# Altium schematic sheet 31-FT4232 UART TO USB BRIDG.SchDoc
size 513 x 386 mm
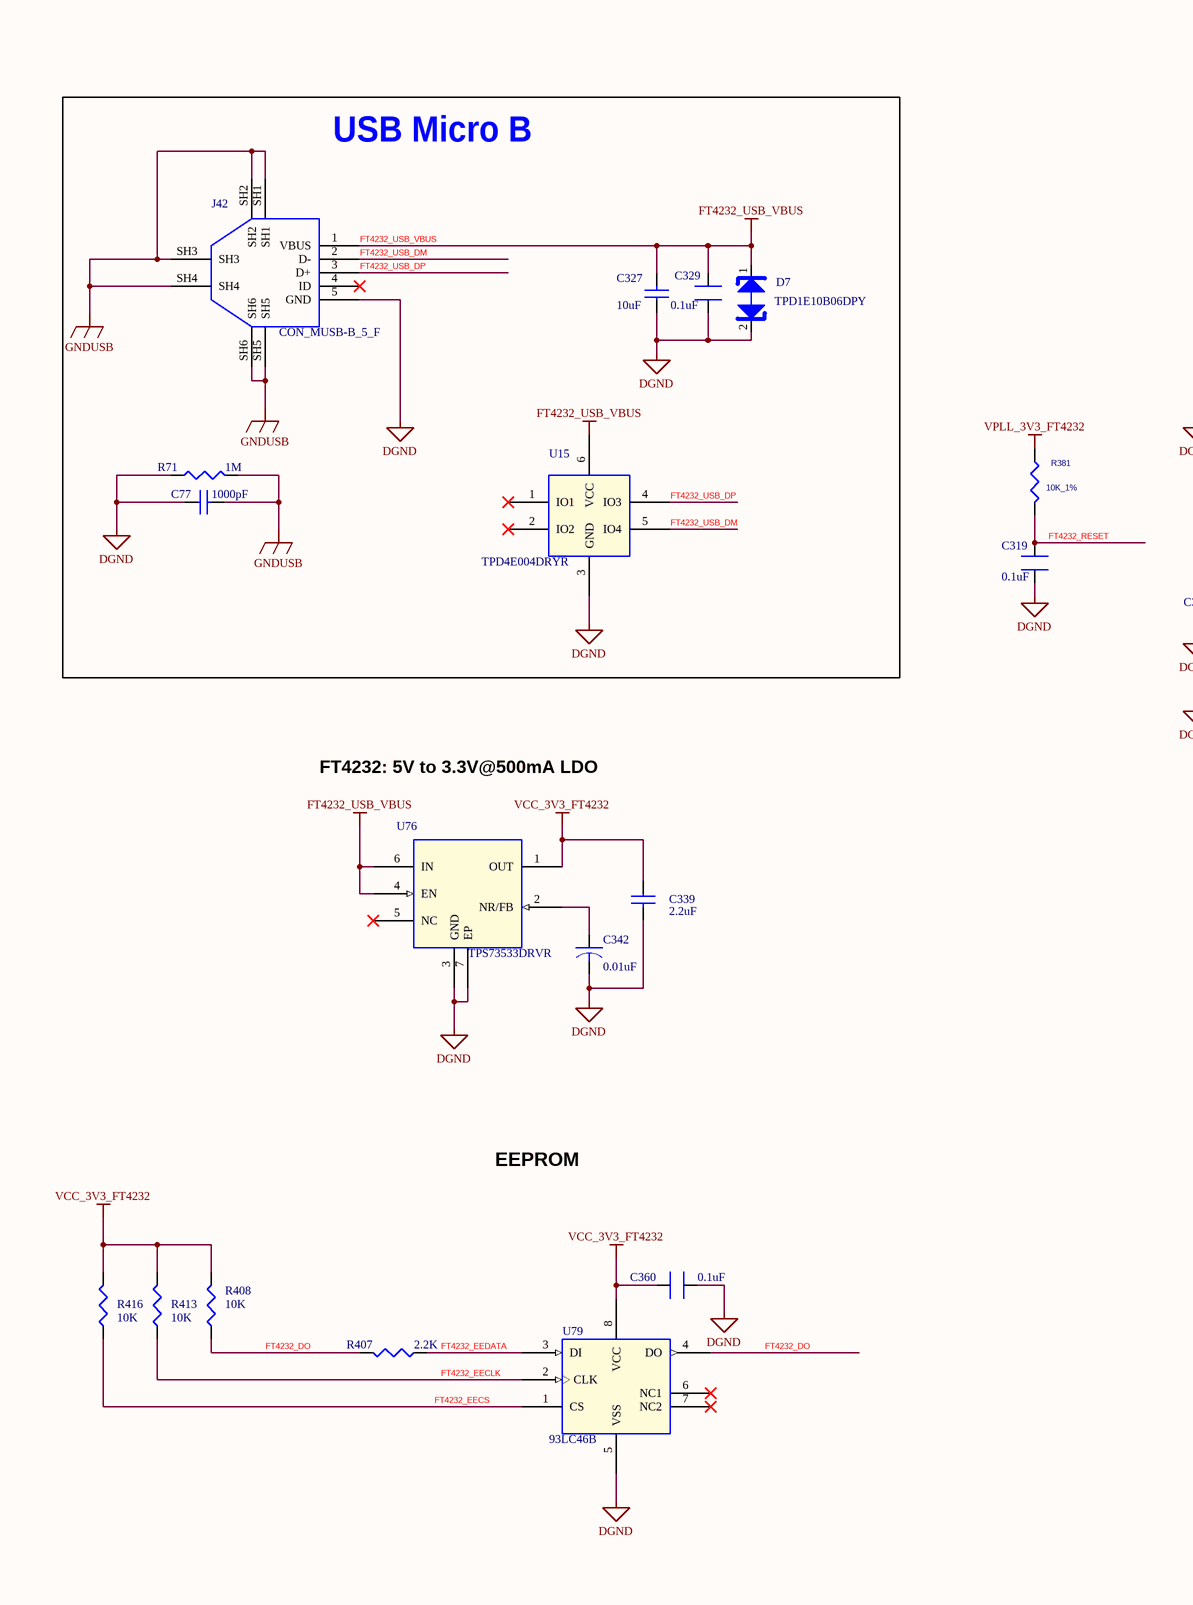
[diagram p0: 31-FT4232 UART TO USB BRIDG.SchDoc, left]
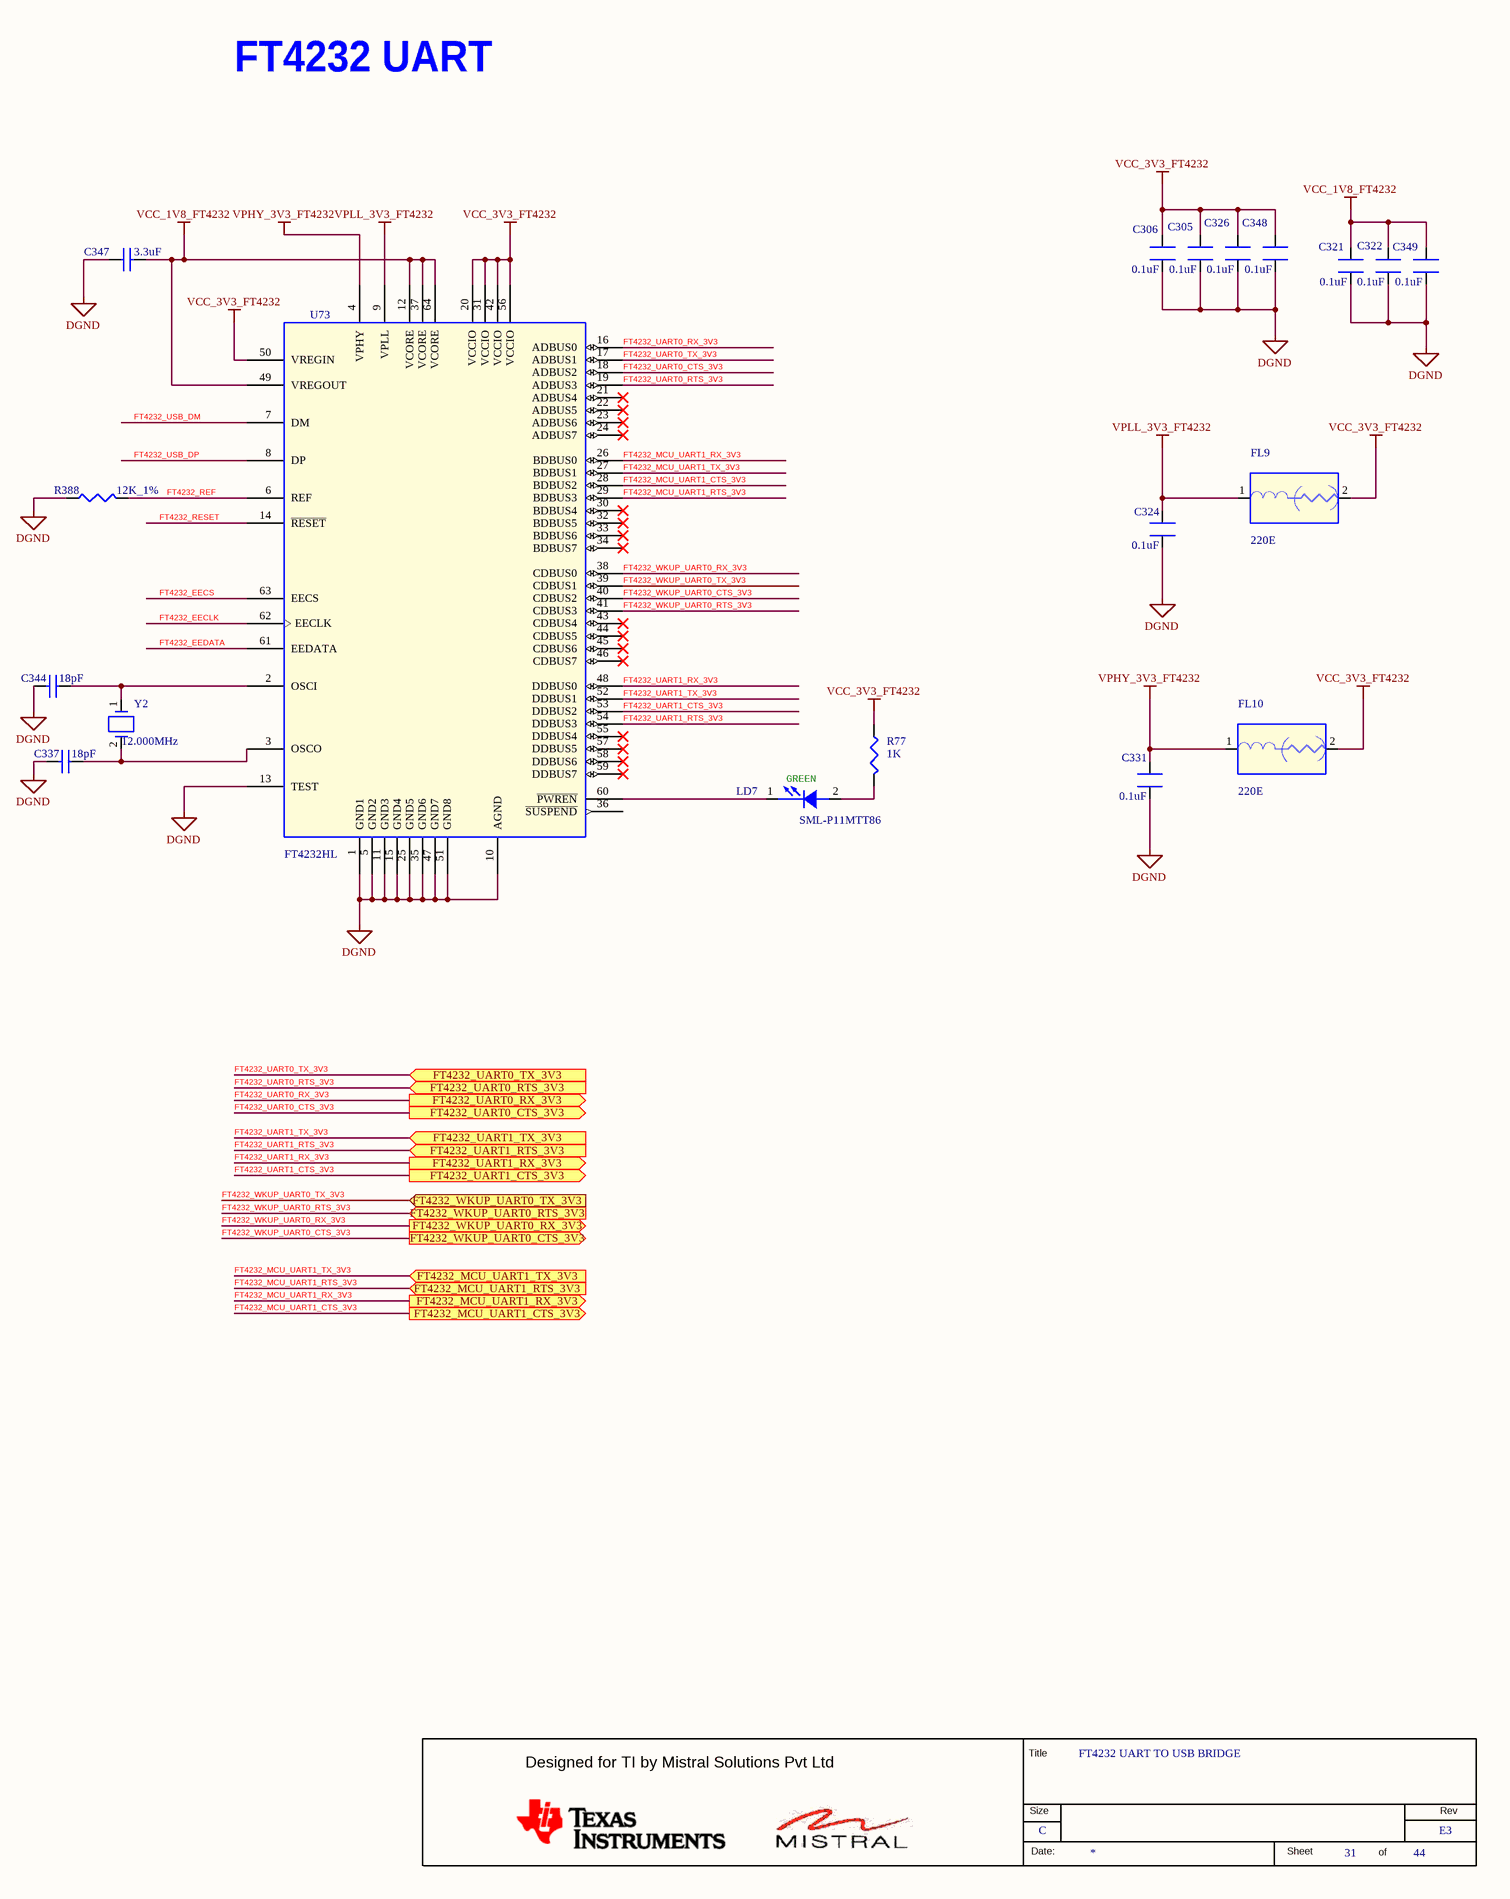
[diagram p1: 31-FT4232 UART TO USB BRIDG.SchDoc, right]

## Parts
*  RevCode: E3  Title: FT4232 UART TO USB BRIDGE  Page Size: C  Page Number: 31  Page Count: 44  (hidden comment: MISTRAL_TITLEBLK_CSIZE)  (graphical)
C77  1000pF  [CAP1206]
C305  0.1uF  [CAP0201_0-5]
C306  0.1uF  [CAP0201_0-5]
C319  0.1uF  [CAP0201_0-5]
C321  0.1uF  [CAP0201_0-5]
C322  0.1uF  [CAP0201_0-5]
C324  0.1uF  [CAP0201_0-5]
C326  0.1uF  [CAP0201_0-5]
C327  10uF  [CAP0603_1]
C329  0.1uF  [CAP0201_0-5]
C331  0.1uF  [CAP0201_0-5]
C337  18pF  [CAP0402_0-75]
C339  2.2uF  [CAP0402_0-75]
C342  0.01uF  [CAP0201_0-5]
C344  18pF  [CAP0402_0-75]
C347  3.3uF  [CAP0402]
C348  0.1uF  [CAP0201_0-5]
C349  0.1uF  [CAP0201_0-5]
C360  0.1uF  [CAP0201_0-5]
D7  TPD1E10B06DPY  [DIO_DFN0402]
FL9  220E  [EMIFIL_BLM15A_0402]
FL10  220E  [EMIFIL_BLM15A_0402]
J42  CON_MUSB-B_5_F  [CON_MUSBB5_1051640001_S_R_S_2-5]
LD7  SML-P11MTT86  [LED_0402_0-3]
R71  1M  [RES0603_0-75]
R77  1K  [RES0201]
R381  10K_1%  [RES0402_0-5]
R388  12K_1%  [RES0402]
R407  2.2K  [RES0402_0-5]
R408  10K  [RES0402_0-5]
R413  10K  [RES0402_0-5]
R416  10K  [RES0402_0-5]
U15  TPD4E004DRYR  [SON6_19-68_60X45]
U73  FT4232HL  [LQFP64_19-68_390X390_1-6]
U76  TPS73533DRVR  [SON6_25-59_85X85]
U79  93LC46B  [MSOP8_25-59_125X125_1-1]
Y2  12.000MHz  [XTAL_ABM3_205X130_SMD]

## Blocks framed on the sheet
USB Micro B: C77 C327 C329 D7 J42 R71 U15

## Ports
FT4232_MCU_UART1_CTS_3V3 (out), FT4232_MCU_UART1_RTS_3V3 (in), FT4232_MCU_UART1_RX_3V3 (out), FT4232_MCU_UART1_TX_3V3 (in), FT4232_UART0_CTS_3V3 (out), FT4232_UART0_RTS_3V3 (in), FT4232_UART0_RX_3V3 (out), FT4232_UART0_TX_3V3 (in), FT4232_UART1_CTS_3V3 (out), FT4232_UART1_RTS_3V3 (in), FT4232_UART1_RX_3V3 (out), FT4232_UART1_TX_3V3 (in), FT4232_WKUP_UART0_CTS_3V3 (out), FT4232_WKUP_UART0_RTS_3V3 (in), FT4232_WKUP_UART0_RX_3V3 (out), FT4232_WKUP_UART0_TX_3V3 (in)

## Nets
DGND: C77.1 C305.1 C306.1 C319.1 C321.1 C322.1 C324.1 C326.1 C327.1 C329.1 C331.1 C337.2 C339.2 C342.2 C344.2 C347.1 C348.1 C349.1 C360.1 D7.2(A) J42.5(GND) R71.1 R388.1 U15.3(GND) U73.1(GND1) U73.5(GND2) U73.10(AGND) U73.11(GND3) U73.13(TEST) U73.15(GND4) U73.25(GND5) U73.35(GND6) U73.47(GND7) U73.51(GND8) U76.3(GND) U76.7(EP) U79.5(VSS)
FT4232_USB_VBUS: C327.2 C329.2 D7.1(K) J42.1(VBUS) U15.6(VCC) U76.4(EN) U76.6(IN)
GNDUSB: C77.2 J42.SH1 J42.SH2 J42.SH3 J42.SH4 J42.SH5 J42.SH6 R71.2
VCC_1V8_FT4232: C321.2 C322.2 C347.2 C349.2 U73.12(VCORE) U73.37(VCORE) U73.49(VREGOUT) U73.64(VCORE)
VCC_3V3_FT4232: C305.2 C306.2 C326.2 C339.1 C348.2 C360.2 FL9.2 FL10.2 R77.1 R408.2 R413.2 R416.2 U73.20(VCCIO) U73.31(VCCIO) U73.42(VCCIO) U73.50(VREGIN) U73.56(VCCIO) U76.1(OUT) U79.8(VCC)
VPHY_3V3_FT4232: C331.2 FL10.1 U73.4(VPHY)
VPLL_3V3_FT4232: C324.2 FL9.1 R381.2 U73.9(VPLL)
FT4232_DO: R407.2 R408.1 U79.4(DO)
FT4232_EECLK: R413.1 U73.62(EECLK) U79.2(CLK)
FT4232_EECS: R416.1 U73.63(EECS) U79.1(CS)
FT4232_EEDATA: R407.1 U73.61(EEDATA) U79.3(DI)
FT4232_MCU_UART1_CTS_3V3: U73.28(BDBUS2) ; port FT4232_MCU_UART1_CTS_3V3
FT4232_MCU_UART1_RTS_3V3: U73.29(BDBUS3) ; port FT4232_MCU_UART1_RTS_3V3
FT4232_MCU_UART1_RX_3V3: U73.26(BDBUS0) ; port FT4232_MCU_UART1_RX_3V3
FT4232_MCU_UART1_TX_3V3: U73.27(BDBUS1) ; port FT4232_MCU_UART1_TX_3V3
FT4232_REF: R388.2 U73.6(REF)
FT4232_RESET: C319.2 R381.1 U73.14(~{RESET})
FT4232_UART0_CTS_3V3: U73.18(ADBUS2) ; port FT4232_UART0_CTS_3V3
FT4232_UART0_RTS_3V3: U73.19(ADBUS3) ; port FT4232_UART0_RTS_3V3
FT4232_UART0_RX_3V3: U73.16(ADBUS0) ; port FT4232_UART0_RX_3V3
FT4232_UART0_TX_3V3: U73.17(ADBUS1) ; port FT4232_UART0_TX_3V3
FT4232_UART1_CTS_3V3: U73.53(DDBUS2) ; port FT4232_UART1_CTS_3V3
FT4232_UART1_RTS_3V3: U73.54(DDBUS3) ; port FT4232_UART1_RTS_3V3
FT4232_UART1_RX_3V3: U73.48(DDBUS0) ; port FT4232_UART1_RX_3V3
FT4232_UART1_TX_3V3: U73.52(DDBUS1) ; port FT4232_UART1_TX_3V3
FT4232_USB_DM: J42.2(D-) U15.5(IO4) U73.7(DM)
FT4232_USB_DP: J42.3(D+) U15.4(IO3) U73.8(DP)
FT4232_WKUP_UART0_CTS_3V3: U73.40(CDBUS2) ; port FT4232_WKUP_UART0_CTS_3V3
FT4232_WKUP_UART0_RTS_3V3: U73.41(CDBUS3) ; port FT4232_WKUP_UART0_RTS_3V3
FT4232_WKUP_UART0_RX_3V3: U73.38(CDBUS0) ; port FT4232_WKUP_UART0_RX_3V3
FT4232_WKUP_UART0_TX_3V3: U73.39(CDBUS1) ; port FT4232_WKUP_UART0_TX_3V3
NetC337_1: C337.1 U73.3(OSCO) Y2.2
NetC342_1: C342.1 U76.2(NR/FB)
NetC344_1: C344.1 U73.2(OSCI) Y2.1
NetLD7_1: LD7.1(CATHODE) U73.60(~{PWREN})
NetLD7_2: LD7.2(ANODE) R77.2

Not connected (* = marked no-connect by the designer): J42 4(ID)*; U15 1(IO1)* 2(IO2)*; U73 21(ADBUS4)* 22(ADBUS5)* 23(ADBUS6)* 24(ADBUS7)* 30(BDBUS4)* 32(BDBUS5)* 33(BDBUS6)* 34(BDBUS7)* 36(~{SUSPEND}) 43(CDBUS4)* 44(CDBUS5)* 45(CDBUS6)* 46(CDBUS7)* 55(DDBUS4)* 57(DDBUS5)* 58(DDBUS6)* 59(DDBUS7)*; U76 5(NC)*; U79 6(NC1)* 7(NC2)*

## Notes on the sheet
- FT4232 UART
- (near LD7) GREEN
- FT4232: 5V to 3.3V@500mA LDO
- EEPROM
- (in symbol MISTRAL_TITLEBLK_CSIZE) Title; Designed for TI by Mistral Solutions Pvt Ltd; Size; Rev; Date:; Sheet; of

## Library data of the parts
* = MISTRAL_TITLEBLK_CSIZE: Issue: 1.0; Page Create Date: March  8, 1995; Page Modify Date: *
C77 = CAP_Dup5: CAP CERAMIC 1000pF 2KV 10% X7R 1206; Part_type: CAPACITORS\CERAMIC; Mfr_part_number: 1206GC102KAT1A; Mfr_name: AVX CORPORATION; Mistral Part No: 120009030147-R; Custom_Duty: 15%; Customs_HS_Code: 85322990; Project: ADR1B; Temperature: -55°C+125°C; Weight: NA; PCB Footprint: CAP1206; Chkd/date: SHREESHAIL/291106; Crtd /date: MAZHAR/281106; Datasheet: Y:\MIS_DATABASE\DATASHEETS\CAPACITORS\AVX_MLC.PDF; Height: 1.50MM; Distributor_part_number: 478-2956-1-ND; Distributor_name: DIGIKEY; Package: 1206; Voltage: 2KV; Tolerance: 10%; Library Ref: CAP; Footprint Ref: CAP1206; Library Path: Y:\MIS_DATABASE\Library\ALTIUM_TOOL\SCHEMATICS_PARTS\MS_DISCRETE_Library.schlib; Footprint Path: Y:\MIS_DATABASE\Library\ALTIUM_TOOL\PCB_FOOTPRINTS\Altium_Footprint_Lib.PcbLib
C305 C321 C324 C326 = CAP_Dup3: CAP CERAMIC 0.1uF 16V 10% X5R 0201; Mistral Part No: 120009030072-R; Mfr_name: MURATA; Mfr_part_number: GRM033R61C104KE84J; Part_type: CAPACITORS\CERAMIC; Project: TI_MAXIE_CPB; Customs_HS_Code: 85322990; Custom_Duty: 15%; Wattage: NA; PCB Footprint: CAP0201_0-5; Tolerance: 10%; Voltage: 16V; Package: 0201; Distributor_name: DIGIKEY; Distributor_part_number: 490-16742-1-ND; Height: 0.33MM; Datasheet: Y:\MIS_DATABASE\DATASHEETS\CAPACITORS\GRM033R61C104KE84.PDF; Crtd /date: MANIRAJA/120218; Chkd/date: MANIRAJA/120218; Weight: 0.33mg; Temperature: -55°C+85°C; MECHANICAL 3D STEP FILE: CAP0201_0-5; Library Ref: CAP
C306 C322 C348 C349 = CAP_Dup3: CAP CERAMIC 0.1uF 16V 10% X5R 0201; Part_type: CAPACITORS\CERAMIC; Mfr_part_number: GRM033R61C104KE84J; Mfr_name: MURATA; Mistral Part No: 120009030072-R; Custom_Duty: 15%; Customs_HS_Code: 85322990; Project: TI_MAXIE_CPB; Wattage: NA; PCB Footprint: CAP0201_0-5; Chkd/date: MANIRAJA/120218; Crtd /date: MANIRAJA/120218; Datasheet: Y:\MIS_DATABASE\DATASHEETS\CAPACITORS\GRM033R61C104KE84.PDF; Height: 0.33MM; Distributor_part_number: 490-16742-1-ND; Distributor_name: DIGIKEY; Package: 0201; Voltage: 16V; Tolerance: 10%; Weight: 0.33mg; Temperature: -55°C+85°C; MECHANICAL 3D STEP FILE: CAP0201_0-5; Library Ref: CAP
C319 C331 C360 = CAP_Dup3: CAP CERAMIC 0.1uF 16V 10% X5R 0201; Part_type: CAPACITORS\CERAMIC; Mfr_part_number: GRM033R61C104KE84J; Mfr_name: MURATA; Mistral Part No: 120009030072-R; Wattage: NA; Custom_Duty: 15%; Customs_HS_Code: 85322990; Project: TI_MAXIE_CPB; PCB Footprint: CAP0201_0-5; MECHANICAL 3D STEP FILE: CAP0201_0-5; Temperature: -55°C+85°C; Weight: 0.33mg; Chkd/date: MANIRAJA/120218; Crtd /date: MANIRAJA/120218; Datasheet: Y:\MIS_DATABASE\DATASHEETS\CAPACITORS\GRM033R61C104KE84.PDF; Height: 0.33MM; Distributor_part_number: 490-16742-1-ND; Distributor_name: DIGIKEY; Package: 0201; Voltage: 16V; Tolerance: 10%; Library Ref: CAP
C327 = CAP_Dup5: CAP CERAMIC 10uF 10V 10% X5R 0603; Part_type: CAPACITORS\CERAMIC; Mfr_part_number: 0603ZD106KAT2A; Mfr_name: AVX CORPORATION; Mistral Part No: 120010080001-R; Custom_Duty: 15%; Customs_HS_Code: 85322990; Project: TI_MAXIE_CPB; Wattage: NA; Chkd/date: MANIRAJA/230118; Crtd /date: MANIRAJA/230118; Datasheet: Y:\MIS_DATABASE\DATASHEETS\CAPACITORS\AVX_MLC.PDF; Height: 0.94MM; Distributor_part_number: 478-10766-1-ND; Distributor_name: DIGIKEY; Package: 0603; Voltage: 10V; Tolerance: 10%; Weight: 2mg; Temperature: -55°C+85°C; MECHANICAL 3D STEP FILE: CAP0603_1; PCB Footprint: CAP0603_1; Library Ref: CAP
C329 = CAP_Dup3: CAP CERAMIC 0.1uF 16V 10% X5R 0201; Mistral Part No: 120009030072-R; Mfr_name: MURATA; Mfr_part_number: GRM033R61C104KE84J; Part_type: CAPACITORS\CERAMIC; Wattage: NA; Project: TI_MAXIE_CPB; Customs_HS_Code: 85322990; Custom_Duty: 15%; PCB Footprint: CAP0201_0-5; MECHANICAL 3D STEP FILE: CAP0201_0-5; Temperature: -55°C+85°C; Weight: 0.33mg; Tolerance: 10%; Voltage: 16V; Package: 0201; Distributor_name: DIGIKEY; Distributor_part_number: 490-16742-1-ND; Height: 0.33MM; Datasheet: Y:\MIS_DATABASE\DATASHEETS\CAPACITORS\GRM033R61C104KE84.PDF; Crtd /date: MANIRAJA/120218; Chkd/date: MANIRAJA/120218; Library Ref: CAP
C337 = CAP_Dup5: CAP CERAMIC 18pF 50V 5% C0G(NP0) 0402; Part_type: CAPACITORS\CERAMIC; Mfr_part_number: GRM1555C1H180JA01D; Mfr_name: MURATA; Mistral Part No: 120014050002-R; Wattage: NA; Custom_Duty: 15%; Customs_HS_Code: 85322990; Project: HUMANWARE_PHOENIX; Temperature: -55°C+125°C; Weight: 6mg; Chkd/date: VASANTHA/150514; Crtd /date: BALACHANDAR/150514; Datasheet: Y:\MIS_DATABASE\DATASHEETS\CAPACITORS\GRM188SERIES.PDF; Height: 0.55MM; Distributor_part_number: 490-5858-1-ND; Distributor_name: DIGIKEY; Package: 0402; Voltage: 50V; Tolerance: 5%; Library Ref: CAP; Footprint Ref: CAP0402_0-75; PCB Footprint: CAP0402_0-75; MECHANICAL 3D STEP FILE: CAP0402_0-75; Library Path: Y:\MIS_DATABASE\Library\ALTIUM_TOOL\SCHEMATICS_PARTS\MS_DISCRETE_Library.schlib; Footprint Path: Y:\MIS_DATABASE\Library\ALTIUM_TOOL\PCB_FOOTPRINTS\Altium_Footprint_Lib.PcbLib
C339 = CAP_Dup5: CAP CERAMIC 2.2uF 10V 20% X5R 0402; Part_type: CAPACITORS\CERAMIC; Mfr_part_number: GRT155R61A225ME01D; Mfr_name: MURATA; Mistral Part No: 120018010016-R; Custom_Duty: 15%; Customs_HS_Code: 85322990; Wattage: NA; Project: TI_MAXIE_CPB; MECHANICAL 3D STEP FILE: CAP0402_0-75; Chkd/date: MANIRAJA/240118; Crtd /date: MANIRAJA/240118; Datasheet: Y:\MIS_DATABASE\DATASHEETS\CAPACITORS\GRT155R61A225ME01.PDF; Temperature: -55°C+85°C; Weight: 0.65mg; Height: 0.55MM; Distributor_part_number: 490-12254-1-ND; Distributor_name: DIGIKEY; Package: 0402; Voltage: 10V; Tolerance: 20%; PCB Footprint: CAP0402_0-75; Library Ref: CAP
C342 = CAP: CAP CERAMIC 0.01uF 25V 10% X5R 0201; Part_type: CAPACITORS\CERAMIC; Mfr_part_number: GRM033R61E103KA12J; Mfr_name: MURATA; Mistral Part No: 120018010007-R; Custom_Duty: 15%; Customs_HS_Code: 85322990; Wattage: NA; Project: TI_MAXIE_CPB; MECHANICAL 3D STEP FILE: CAP0201_0-5; Chkd/date: MANIRAJA/230118; Crtd /date: MANIRAJA/230118; Datasheet: Y:\MIS_DATABASE\DATASHEETS\CAPACITORS\GRM033R61E103KA12.PDF; Temperature: -55°C+85°C; Weight: 0.33mg; Height: 0.33MM; Distributor_part_number: GRM033R61E103KA12J-ND; Distributor_name: DIGIKEY; Package: 0201; Voltage: 25V; Tolerance: 10%; PCB Footprint: CAP0201_0-5; Library Ref: CAP
C344 = CAP_Dup5: CAP CERAMIC 18pF 50V 5% C0G(NP0) 0402; Mistral Part No: 120014050002-R; Mfr_name: MURATA; Mfr_part_number: GRM1555C1H180JA01D; Part_type: CAPACITORS\CERAMIC; Wattage: NA; Project: HUMANWARE_PHOENIX; Customs_HS_Code: 85322990; Custom_Duty: 15%; Temperature: -55°C+125°C; Weight: 6mg; Tolerance: 5%; Voltage: 50V; Package: 0402; Distributor_name: DIGIKEY; Distributor_part_number: 490-5858-1-ND; Height: 0.55MM; Datasheet: Y:\MIS_DATABASE\DATASHEETS\CAPACITORS\GRM188SERIES.PDF; Crtd /date: BALACHANDAR/150514; Chkd/date: VASANTHA/150514; Library Ref: CAP; Footprint Ref: CAP0402_0-75; PCB Footprint: CAP0402_0-75; MECHANICAL 3D STEP FILE: CAP0402_0-75; Library Path: Y:\MIS_DATABASE\Library\ALTIUM_TOOL\SCHEMATICS_PARTS\MS_DISCRETE_Library.schlib; Footprint Path: Y:\MIS_DATABASE\Library\ALTIUM_TOOL\PCB_FOOTPRINTS\Altium_Footprint_Lib.PcbLib
C347 = CAP_Dup5: CAP CERAMIC 3.3uF 6.3V 20% X5R 0402; Part_type: CAPACITORS\CERAMIC; Mfr_part_number: C1005X5R0J335M050BC; Mfr_name: TDK CORPORATION; Mistral Part No: 120015020002-R; Custom_Duty: 15%; Customs_HS_Code: 85322990; Wattage: NA; Project: GALILEO_EVM; PCB Footprint: CAP0402; Chkd/date: NAVEED/270315; Crtd /date: VASANTHA/130215; Datasheet: Y:\MIS_DATABASE\DATASHEETS\CAPACITORS\TDK_CAP.PDF; Temperature: -55°C+85°C; Weight: NA; Height: 0.60MM; Distributor_part_number: 445-7394-1-ND; Distributor_name: DIGIKEY; Package: 0402; Voltage: 6.3V; Tolerance: 20%; Library Ref: CAP
D7 = DIODE_PESD: DIODE 1CH ESD PROTECTION SMD(0402); Part_type: DIODE\MISC; Mfr_name: TEXAS INSTRUMENTS; Mistral Part No: 130014110022-R; Custom_Duty: 15%; Customs_HS_Code: 85423100; Wattage: NA; Project: GALILEO_EVM; PCB Footprint: DIO_DFN0402; Chkd/date: USMAN/021214; Crtd /date: VASANTHA/181114; Datasheet: Y:\MIS_DATABASE\DATASHEETS\ICS\INTERFACE\TPD1E10B06.PDF; Temperature: -40°C+125°C; Weight: NA; Height: 0.45MM; Distributor_part_number: 296-30406-1-ND; Distributor_name: DIGIKEY; Package: SMD; Voltage: NA; Tolerance: NA; Mfr_part_number: TPD1E10B06DPY; Library Ref: DIODE_PESD
FL9 = EMIFILTER_IND: FERRITE CHIP 220E 0.3A 0402; Part_type: MISC\FILTER; Mfr_part_number: BLM15GG221SN1D; Mfr_name: MURATA; Mistral Part No: 130013100020-R; Custom_Duty: 15%; Customs_HS_Code: 85412900; Wattage: NA; Tolerance: 25%; Project: C-BAND_SYNTH; PCB Footprint: EMIFIL_BLM15A_0402; Chkd/date: VASANTHA/270715; Crtd /date: USMAN/151013; Datasheet: Y:\MIS_DATABASE\DATASHEETS\DISCRETES\INDUCTORS\BLM18K-SERIES.PDF; Temperature: -55°C+125°C; Weight: NA; Height: 0.55MM; Distributor_part_number: 490-5197-1-ND; Distributor_name: DIGIKEY; Package: 0402; Voltage: NA; Library Ref: EMIFILTER_IND
FL10 = EMIFILTER_IND: FERRITE CHIP 220E 0.3A 0402; Mistral Part No: 130013100020-R; Mfr_name: MURATA; Mfr_part_number: BLM15GG221SN1D; Part_type: MISC\FILTER; Project: C-BAND_SYNTH; Tolerance: 25%; Voltage: NA; Customs_HS_Code: 85412900; Custom_Duty: 15%; PCB Footprint: EMIFIL_BLM15A_0402; Wattage: NA; Package: 0402; Distributor_name: DIGIKEY; Distributor_part_number: 490-5197-1-ND; Height: 0.55MM; Weight: NA; Temperature: -55°C+125°C; Datasheet: Y:\MIS_DATABASE\DATASHEETS\DISCRETES\INDUCTORS\BLM18K-SERIES.PDF; Crtd /date: USMAN/151013; Chkd/date: VASANTHA/270715; Library Ref: EMIFILTER_IND
J42 = CON_MUSB-B_5_1051640001: CON MICRO USB-B TYPE 5POS FEMALE RT SMD; Part_type: CONNECTOR\USB; Mfr_name: MOLEX; Mistral Part No: 150017080018-R; Custom_Duty: 24%; Customs_HS_Code: 85369090; Wattage: NA; Project: TI_MAXIE_CPB; MECHANICAL 3D STEP FILE: CON_MUSBB5_1051640001_S_R_S_2-5; Chkd/date: MANIRAJA/230817; Crtd /date: MANIRAJA/230817; Datasheet: Y:\MIS_DATABASE\DATASHEETS\CONNECTORS\1051640001.PDF; Temperature: -35°C+85°C; Weight: 234mg; Height: 2.45MM; Distributor_part_number: WM11263CT-ND; Distributor_name: DIGIKEY; Package: SMD; Voltage: NA; Tolerance: NA; Mfr_part_number: 1051640001; PCB Footprint: CON_MUSBB5_1051640001_S_R_S_2-5; Library Ref: CON_MUSB-B_5_1051640001
LD7 = DIODE_LED: DIODE LED GREEN 0402; Mistral Part No: 130010060029-R; Mfr_name: ROHM; Part_type: OPTO\LED; Wattage: NA; Project: XMC660; Customs_HS_Code: 85439000; Custom_Duty: 24%; PCB Footprint: LED_0402_0-3; Footprint Path: Y:\MIS_DATABASE\Library\ALTIUM_TOOL\PCB_FOOTPRINTS\Altium_Footprint_Lib.PcbLib; Library Path: Y:\MIS_DATABASE\Library\ALTIUM_TOOL\SCHEMATICS_PARTS\MS_DISCRETE_Library.schlib; MECHANICAL 3D STEP FILE: LED_0402_0-3; Voltage: NA; Tolerance: NA; Mfr_part_number: SML-P11MTT86; Package: 0402; Distributor_name: DIGIKEY; Distributor_part_number: 511-1652-1-ND; Height: 0.25MM; Weight: NA; Temperature: -40°C+85°C; Datasheet: Y:\MIS_DATABASE\DATASHEETS\DISCRETES\LEDS\SML-P11.PDF; Crtd /date: MUDDU/190610; Chkd/date: VASANTHA/281216; Library Ref: DIODE_LED
R71 = RESISTOR_Dup5: RES 1M 1/10W 5% 0603; Mistral Part No: 110009030413-R; Mfr_name: PANASONIC-ECG; Mfr_part_number: ERJ-3GEYJ105V; Part_type: RESISTORS\FIXED; Project: BSN; Voltage: NA; Customs_HS_Code: 85332119; Custom_Duty: 15%; MECHANICAL 3D STEP FILE: RES0603_0-75; PCB Footprint: RES0603_0-75; Tolerance: 5%; Wattage: 1/10W; Package: 0603; Distributor_name: DIGIKEY; Distributor_part_number: P1.0MGCT-ND; Height: 0.55MM; Weight: 2mg; Temperature: -55°C+155°C; Datasheet: Y:\MIS_DATABASE\DATASHEETS\RESISTORS\PAN-ERJ-3GE.PDF; Crtd /date: USMAN/111207; Chkd/date: VASANTHA/060217; Library Ref: RESISTOR
R77 = RESISTOR_Dup5: RES 1K 1/20W 5% 0201; Mistral Part No: 110015080014-R; Mfr_name: VISHAY; Mfr_part_number: CRCW02011K00FKED; Part_type: RESISTORS\FIXED; Project: OCTASIC_3000; Voltage: NA; Customs_HS_Code: 85332119; Custom_Duty: 15%; PCB Footprint: RES0201; Tolerance: 5%; Wattage: 1/20W; Package: 0201; Distributor_name: DIGIKEY; Distributor_part_number: 541-1.00KAABCT-ND; Height: 0.28MM; Weight: NA; Temperature: -55°C+155°C; Datasheet: Y:\MIS_DATABASE\DATASHEETS\RESISTORS\CRCW0201.PDF; Crtd /date: JEBRAN/110815; Chkd/date: JEBRAN/110815; Library Ref: RESISTOR
R381 = RESISTOR_Dup2: RES 10K 1/16W 1% 0402; Mistral Part No: 110009030220-P; Mfr_name: YAGEO AMERICA; Mfr_part_number: RC0402FR-0710KL; Part_type: RESISTORS\FIXED; Voltage: NA; Project: VOCERA; Customs_HS_Code: 85332119; Custom_Duty: 15%; PCB Footprint: RES0402_0-5; MECHANICAL 3D STEP FILE: RES0402_0-5; Temperature: -55°C+155°C; Weight: 0.65mg; Tolerance: 1%; Wattage: 1/16W; Package: 0402; Distributor_name: DIGIKEY; Distributor_part_number: 311-10.0KLRTR-ND; Height: 0.40MM; Datasheet: Y:\MIS_DATABASE\DATASHEETS\RESISTORS\YAGEO-RC0402.PDF; Crtd /date: GEETHA/290506; Chkd/date: VASANTHA/201216; RoHS: Pb-Free; Library Ref: RESISTOR; Footprint Ref: RES0402_0-5; Library Path: Y:\MIS_DATABASE\Library\ALTIUM_TOOL\SCHEMATICS_PARTS\MS_DISCRETE_Library.schlib; Footprint Path: Y:\MIS_DATABASE\Library\ALTIUM_TOOL\PCB_FOOTPRINTS\Altium_Footprint_Lib.PcbLib
R388 = RESISTOR_Dup5: RES 12K 1/16W 1% 0402; Part_type: RESISTORS\FIXED; Mfr_part_number: ERJ-2RKF1202X; Mfr_name: PANASONIC-ECG; Mistral Part No: 110009030289-R; Custom_Duty: 15%; Customs_HS_Code: 85332119; Voltage: NA; Project: TI_C5545; PCB Footprint: RES0402; Chkd/date: VASANTHA/041215; Crtd /date: VASANTHA/041215; Datasheet: Y:\MIS_DATABASE\DATASHEETS\RESISTORS\PAN-ERJSERIES.PDF; Temperature: -55°C+155°C; Weight: NA; Height: 0.40MM; Distributor_part_number: P12.0KLCT-ND; Distributor_name: DIGIKEY; Package: 0402; Wattage: 1/16W; Tolerance: 1%; Library Ref: RESISTOR
R407 = RESISTOR_Dup5: RES 2.2K 1/16W 5% 0402; Part_type: RESISTORS\FIXED; Mfr_part_number: RC0402JR-072K2L; Mfr_name: YAGEO AMERICA; Mistral Part No: 110010120018-R; Custom_Duty: 15%; Customs_HS_Code: 85332119; Voltage: NA; Project: TE4; PCB Footprint: RES0402_0-5; Footprint Path: VALUE IS VAILABLE 3 TIMES; MECHANICAL 3D STEP FILE: RES0402_0-5; Chkd/date: VASANTHA/061216; Crtd /date: BAVISH/021210; Datasheet: Y:\MIS_DATABASE\DATASHEETS\RESISTORS\YAGEO.PDF; Temperature: -55°C+155°C; Weight: 0.65mg; Height: 0.40MM; Distributor_part_number: 311-2.2KJRCT-ND; Distributor_name: DIGIKEY; Package: 0402; Wattage: 1/16W; Tolerance: 5%; Library Ref: RESISTOR
R408 R413 = RESISTOR_Dup5: RES 10K 1/16W 5% 0402; Mistral Part No: 110009030208-R; Mfr_name: YAGEO AMERICA; Mfr_part_number: RC0402JR-0710KL; Part_type: RESISTORS\FIXED; Project: HSE; Voltage: NA; Customs_HS_Code: 85332119; Custom_Duty: 15%; PCB Footprint: RES0402_0-5; Tolerance: 5%; Wattage: 1/16W; Package: 0402; Distributor_name: DIGIKEY; Distributor_part_number: 311-10KJRCT-ND; Height: 0.40MM; Weight: 0.65mg; Temperature: -55°C+155°C; Datasheet: Y:\MIS_DATABASE\DATASHEETS\RESISTORS\YAGEO-RC0402.PDF; Crtd /date: MAZHAR/230805; Chkd/date: VASANTHA/061216; RoHS: Pb-Free; MECHANICAL 3D STEP FILE: RES0402_0-5; Library Ref: RESISTOR; Footprint Ref: RES0402_0-5; Library Path: Y:\MIS_DATABASE\Library\ALTIUM_TOOL\SCHEMATICS_PARTS\MS_DISCRETE_Library.schlib; Footprint Path: Y:\MIS_DATABASE\Library\ALTIUM_TOOL\PCB_FOOTPRINTS\Altium_Footprint_Lib.PcbLib
R416 = RESISTOR_Dup5: RES 10K 1/16W 5% 0402; Part_type: RESISTORS\FIXED; Mfr_part_number: RC0402JR-0710KL; Mfr_name: YAGEO AMERICA; Mistral Part No: 110009030208-R; Custom_Duty: 15%; Customs_HS_Code: 85332119; Voltage: NA; Project: HSE; PCB Footprint: RES0402_0-5; MECHANICAL 3D STEP FILE: RES0402_0-5; RoHS: Pb-Free; Chkd/date: VASANTHA/061216; Crtd /date: MAZHAR/230805; Datasheet: Y:\MIS_DATABASE\DATASHEETS\RESISTORS\YAGEO-RC0402.PDF; Temperature: -55°C+155°C; Weight: 0.65mg; Height: 0.40MM; Distributor_part_number: 311-10KJRCT-ND; Distributor_name: DIGIKEY; Package: 0402; Wattage: 1/16W; Tolerance: 5%; Library Ref: RESISTOR; Footprint Ref: RES0402_0-5; Library Path: Y:\MIS_DATABASE\Library\ALTIUM_TOOL\SCHEMATICS_PARTS\MS_DISCRETE_Library.schlib; Footprint Path: Y:\MIS_DATABASE\Library\ALTIUM_TOOL\PCB_FOOTPRINTS\Altium_Footprint_Lib.PcbLib
U15 = TPD4E004_SON6: IC 4CH ESD-PROT ARRAY SON6; Part_type: ICS\INTERFACE; Mfr_name: TEXAS INSTRUMENTS; Mistral Part No: 141010020012-P; Custom_Duty: 15%; Customs_HS_Code: 85423100; Project: BUG_BASE-II; Library Ref: TPD4E004_SON6; RoHS: Pb-Free; Chkd/date: SUHAS/131210; Crtd /date: MUDDU/010310; Datasheet: Y:\MIS_DATABASE\DATASHEETS\ICS\INTERFACE\TPD4E004.PDF; Temperature: -40°C+85°C; Weight: NA; Height: 0.60MM; Distributor_part_number: 296-23618-1-ND; Distributor_name: DIGIKEY; Package: SON6; Mfr_part_number: TPD4E004DRYR; PCB Footprint: SON6_19-68_60X45
U73 = FT4232H _LQFP64: IC HIGH SPEED QUAD USB UART LQFP64; Mistral Part No: 141013080006-R; Mfr_name: FTDI; Mfr_part_number: FT4232HL-REEL; Part_type: ICS\DIGITAL\PERIPHERAL; Project: DM37XX; Tolerance: NA; Customs_HS_Code: 85423100; Custom_Duty: 15%; PCB Footprint: LQFP64_19-68_390X390_1-6; MECHANICAL 3D STEP FILE: LQFP64_19-68_390X390_1-6; Voltage: NA; Wattage: NA; Package: LQFP64; Distributor_name: DIGIKEY; Distributor_part_number: 768-1026-1-ND; Height: 1.60MM; Weight: 342.7mg; Temperature: -40°C+85°C; Datasheet: Y:\MIS_DATABASE\DATASHEETS\ICS\DIGITAL\PERIPHERAL\FT4232HX.PDF; Crtd /date: VIJAYALAKSHMI/120813; Chkd/date: MANIRAJA/110917; Library Ref: FT4232H _LQFP64
U76 = TPS73501DRVR_SON6: IC 500mA LOW DROPOUT REGULATOR SON6; Mistral Part No: 142014100001-R; Mfr_name: TEXAS INSTRUMENTS; Part_type: ICS\POWER\VOLTAGE REGULATOR; Project: BLUETOOTH_WATCH; Tolerance: NA; Customs_HS_Code: 85423100; Custom_Duty: 15%; Mfr_part_number: TPS73533DRVR; Voltage: NA; Wattage: NA; Package: SON6; Distributor_name: DIGIKEY; Distributor_part_number: TPS73533DRVR-ND; Height: 0.80MM; Weight: NA; Temperature: -40°C+125°C; Datasheet: Y:\MIS_DATABASE\DATASHEETS\ICS\POWER\TPS735.PDF; Crtd /date: NAVEED/011014; Chkd/date: VASANTHA/280915; PCB Footprint: SON6_25-59_85X85; Library Ref: TPS73501DRVR_SON6
U79 = 93LC46B_MSOP8: IC 1K MICROWIRE COMPATIBLE SERIAL EEPROM MSOP8; Part_type: ICS\DIGITAL\MEMORY; Mfr_part_number: 93LC46B-I/MS; Mfr_name: MICROCHIP; Mistral Part No: 141118020002-R; Custom_Duty: 15%; Customs_HS_Code: 85423100; Wattage: NA; Project: TI_MAXIE_CPB; PCB Footprint: MSOP8_25-59_125X125_1-1; Footprint Path: Y:\MIS_DATABASE\Library\ALTIUM_TOOL\PCB_FOOTPRINTS\Altium_Footprint_Lib.PcbLib; Library Path: Y:\MIS_DATABASE\Library\ALTIUM_TOOL\SCHEMATICS_PARTS\MS_MISCMEMORY_Library.schlib; MECHANICAL 3D STEP FILE: MSOP8_25-59_125X125_1-1; Chkd/date: MANIRAJA/150218; Crtd /date: ALVY/150218; Datasheet: Y:\MIS_DATABASE\DATASHEETS\ICS\MEMORY\93LC46B.PDF; Temperature: -40°C+85°C; Weight: 140mg; Height: 1.10MM; Distributor_part_number: 93LC46B-I/MS-ND; Distributor_name: DIGIKEY; Package: MSOP8; Voltage: NA; Tolerance: NA; Library Ref: 93LC46B_MSOP8; Footprint Ref: MSOP8_25-59_125X125_1-1
Y2 = CRY: CRY 12MHz SMD; Part_type: CRYSTAL; Mfr_part_number: 445I23D12M00000; Mfr_name: CTS; Mistral Part No: 130016020045-R; Custom_Duty: 24%; Customs_HS_Code: 85439000; Wattage: NA; Project: AMBISCOPE; PCB Footprint: XTAL_ABM3_205X130_SMD; Chkd/date: VASANTHA/140316; Crtd /date: JEBRAN/240216; Datasheet: Y:\MIS_DATABASE\DATASHEETS\MISC\CRY_OSC\ABM3.PDF; Temperature: -40°C+85°C; Weight: NA; Height: 1.50MM; Distributor_part_number: 535-10634-1-ND; Distributor_name: DIGIKEY; Package: SMD; Voltage: NA; Tolerance: NA; Library Ref: CRY